# Altium schematic sheet LowPass_Filter.SchDoc
size A4; CompanyName: Technische Hochschule Nürnberg Georg Simon Ohm; Organization: UltraZohm; Address1: Kesslerplatz 12; Address2: 90489 Nürnberg; Address3: GERMANY; SheetNumber: 3; SheetTotal: 5; Website: www.ultrazohm.com
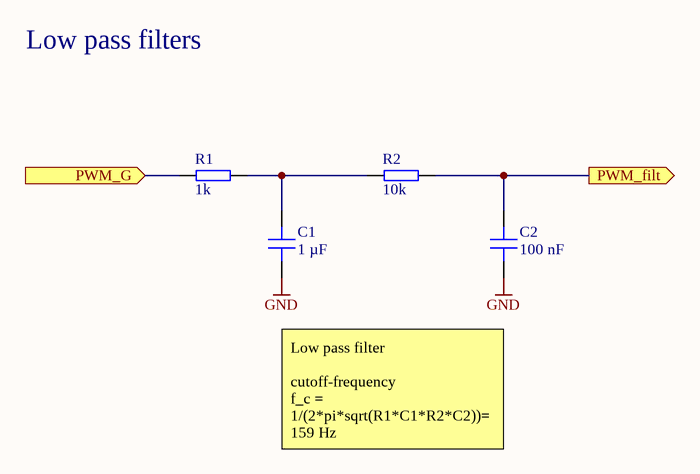
[diagram p0: LowPass_Filter.SchDoc]

## Parts
C1  1 µF  [C_0603]
C2  100 nF  [C_0603]
R1  1k  [RES 0603_1608]
R2  10k  [RES 0603_1608]

## Ports
PWM_filt (out), PWM_G (in)

## Nets
GND: C1.1 C2.1
PWM_filt: C2.2 R2.2 ; port PWM_filt
PWM_G: R1.1 ; port PWM_G
NetC1_2: C1.2 R1.2 R2.1

## Notes on the sheet
- Low pass filters
- Low pass filter
  cutoff-frequency
  f_c = 1/(2*pi*sqrt(R1*C1*R2*C2))= 159 Hz
- Title
- Revision:
- Design Engineer:
- Date:
- Project:
- Sheet
- of

## Library data of the parts
C1 = UMK107AB7105KA-T: 50V 1uF X7R ±10% 0603 Multilayer Ceramic Capacitors MLCC - SMD/SMT ROHS; Manufacturer: Taiyo Yuden; Voltage Rating: 50 VDC; Created from: NDiringer; Manufacturer Part Number: UMK107AB7105KA-T; PartID: 98; Created On: 09.08.2022 09:35:02; ComponentLink1Description: Datasheet; ComponentLink1URL: https://www.mouser.de/datasheet/2/396/mlcc02_e-1307760.pdf; Component Type: Capacitor 0603; Device Package: 0603; Last Updated: 21.09.2022 16:11:37; Mounting Type: SMD; Operating Temperature: -55 - 125°C; Series: X7R; Supplier 1: LCSC; Supplier Part Number 1: C15849; Supplier 2: Mouser; Supplier Part Number 2: 963-UMK107AB7105MA-T; Type: Capacitor; Tolerance: 10 %; Value: 1 µF; Live Cycle Status: 1; LCSC Part Number: C15849; Stock number: not stored
C2 = C0603C104K5RAC3121: Capacitor 0603, 50 VDC, 100nF, X7R; Manufacturer: KEMET; Tolerance: 10 %; Voltage Rating: 50 VDC; Created from: DHufnagel; Manufacturer Part Number: C0603C104K5RAC3121; PartID: 99; Created On: 11.08.2022 14:33:29; ComponentLink1Description: Datasheet; ComponentLink1URL: https://www.mouser.de/datasheet/2/212/KEM_C1023_X7R_AUTO_SMD-1093309.pdf; Component Type: Capacitor 0603; Device Package: 0603; Last Updated: 19.08.2022 08:26:58; Mounting Type: SMD; Operating Temperature: -55 - 125°C; Series: X7R; Supplier 1: Mouser; Supplier Part Number 1: 80-C603C104K5RAC3121; Supplier 2: LCSC; Supplier Part Number 2: C14663; Type: Capacitor; Value: 100 nF; Live Cycle Status: 1; LCSC Part Number: C14663; Stock number: not stored
R1 = PCF-W0603LF-03-1001-B-P-LT: SMD resistor 0.1%; Manufacturer: IRC / TT Electronics; Created from: MGremer; Manufacturer Part Number: PCF-W0603LF-03-1001-B-P-LT; PartID: 163; Created On: 14.12.2020 16:17:14; ComponentLink1Description: Datasheet; ComponentLink1URL: https://www.mouser.de/datasheet/2/414/PCF-1528243.pdf; Component Type: SMD resistor; Device Package: 0603; Last Updated: 21.02.2024 15:45:55; Mounting Type: SMD; Supplier 1: Mouser; Supplier Part Number 1: 66-PCFW0603LF031001B; Type: Resistor; Tolerance: 0.1%; Value: 1k; Live Cycle Status: 1; Stock number: not stored; LCSC Part Number: C110776
R2 = RQ73C1J10KBTD: SMD resistor 0.1%, 10ppm; Manufacturer: TE Connectivity; Created from: DHufnagel; Manufacturer Part Number: RQ73C1J10KBTD; PartID: 231; Created On: 14.12.2020 16:17:14; ComponentLink1Description: Datasheet; ComponentLink1URL: https://www.mouser.de/datasheet/2/418/5/ENG_DS_1773270_2_B-1533717.pdf; Component Type: SMD resistor; Device Package: 0603; Last Updated: 21.02.2024 15:51:17; Mounting Type: SMD; Supplier 1: Mouser; Supplier Part Number 1: 279-RQ73C1J10KBTD; Supplier 2: LCSC; Supplier Part Number 2: C25804; Type: Resistor; Tolerance: 0.1%; Value: 10k; Live Cycle Status: 1; Stock number: not stored; LCSC Part Number: C25804